# Altium schematic sheet Sheet1.SchDoc
size A
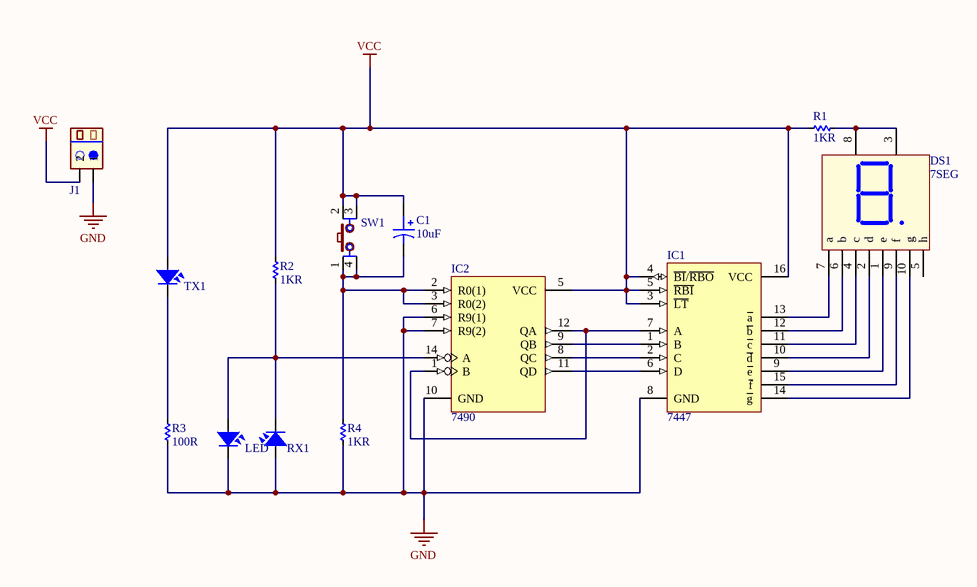
[diagram p0: Sheet1.SchDoc]

## Parts
C1  value 10uF  [RADIAL C]  (hidden comment: Cap Pol)
DS1  7SEG  [LED7SEG-1-0.56]
IC1  7447  [DIP16]
IC2  7490  [DIP14]
J1  CON.Domino2  [Domino 2M]  (value not drawn)
LED  LED  [LED-5-RED]  (value not drawn)
R1  1KR  [RES-1/4W]
R2  1KR  [RES-1/4W]
R3  100R  [RES-1/4W]
R4  1KR  [RES-1/4W]
RX1  LED  [LED-5MM-BLUE]  (value not drawn)
SW1  SW  [SW2-DIP]  (value not drawn)
TX1  LED  [LED-5MM-WHITE]  (value not drawn)

## Nets
GND: IC1.8(GND) IC2.6(R9(1)) IC2.7(R9(2)) IC2.10(GND) J1.1 LED.2 R3.2 R4.2 RX1.1
VCC: C1.1 IC1.3(~{LT}) IC1.4(~{BI}/~{RBO}) IC1.5(~{RBI}) IC1.16(VCC) IC2.5(VCC) J1.2 R1.1 R2.1 SW1.2 SW1.3 TX1.1
NetC1_2: C1.2 IC2.2(R0(1)) IC2.3(R0(2)) R4.1 SW1.1 SW1.4
NetDS1_1: DS1.1(e) IC1.9(~{e})
NetDS1_2: DS1.2(d) IC1.10(~{d})
NetDS1_3: DS1.3(Vcc) DS1.8(Vcc) R1.2
NetDS1_4: DS1.4(c) IC1.11(~{c})
NetDS1_6: DS1.6(b) IC1.12(~{b})
NetDS1_7: DS1.7(a) IC1.13(~{a})
NetDS1_9: DS1.9(f) IC1.15(~{f})
NetDS1_10: DS1.10(g) IC1.14(~{g})
NetIC1_1: IC1.1(B) IC2.9(QB)
NetIC1_2: IC1.2(C) IC2.8(QC)
NetIC1_6: IC1.6(D) IC2.11(QD)
NetIC1_7: IC1.7(A) IC2.1(B) IC2.12(QA)
NetIC2_14: IC2.14(A) LED.1 R2.2 RX1.2
NetR3_1: R3.1 TX1.2

Not connected (* = marked no-connect by the designer): DS1 5(h)

## Library data of the parts
C1 = Cap Pol: Polarized Capacitor; Published: 8-Jun-2000; LatestRevisionDate: 17-Jul-2002; LatestRevisionNote: Re-released for DXP Platform.; PackageReference: POLAR0.8; Publisher: Altium Limited
DS1 = LED7SEG-1: 14.2 mm General Purpose Blue 7-Segment Display: CC, RH DP, Gray Surface; MinimumIntensity: 2020 ucd; Note: IF = 10 mA; Published: 8-Jun-2000; LatestRevisionDate: 17-Dec-2003; LatestRevisionNote: Schematic revised, PCB Footprint replaced.; DatasheetDocument: 24-Sep-2002; PackageDocument: 24-Sep-2002; PackageReference: H; Publisher: Altium Limited; Colour: Blue; ComponentLink1Description: Manufacturer Link; ComponentLink1URL: http://www.agilent.com/
IC1 = 7447: BCD to 7-Segment Decoder/Driver; Value: 7447 , 74247
IC2 = 7490: 4-Bit Decade Counter; Value: 7490
J1 = CON.Domino2: 2 pins Domino Header; Publisher: Hoang Nguyen; ComponentLink1Description: Digikey Part link; ComponentLink2Description: Open DataSheet; ComponentLink2URL: H:\LIBRARY\LIBRARY.Datasheet\; Price: 2000VND
LED RX1 TX1 = LED: LED Single colour Green and Red; Value: LED 3 ly Single Colour
R1-R4 = Res: Manufacturer: Generic Components; Class: Passive; SubClass: 1k; Published: 08/06/2000; Publisher: Altium Hobart Technology Centre
SW1 = SW4: Switch button 4 pin; Value: Button chip 4 pin